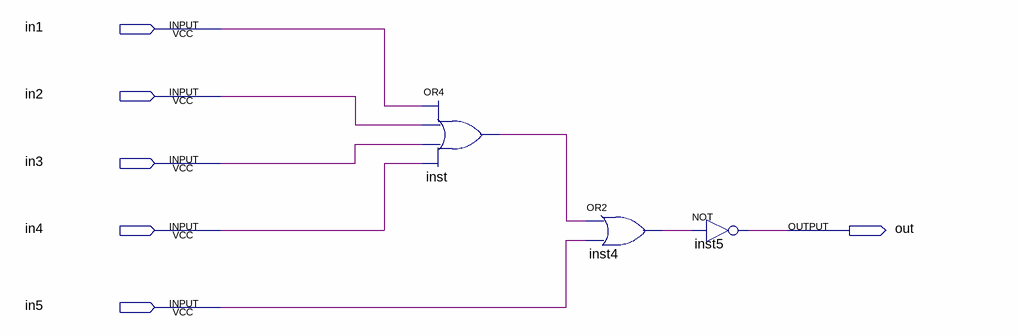
[diagram p0: schematic sheet]
// Quartus schematic NOR_5.bdf as structural Verilog: 3 symbols, 6 pins
module NOR_5 (
  input  in1,
  input  in2,
  input  in3,
  input  in4,
  input  in5,
  output out
);

  wire inst4_out, inst_out;

  or inst (inst_out, in1, in2, in3, in4);
  or inst4 (inst4_out, inst_out, in5);
  not inst5 (out, inst4_out);
endmodule
